# EAGLE schematic mcp3008_rpi_new (EAGLE 7.2.0)
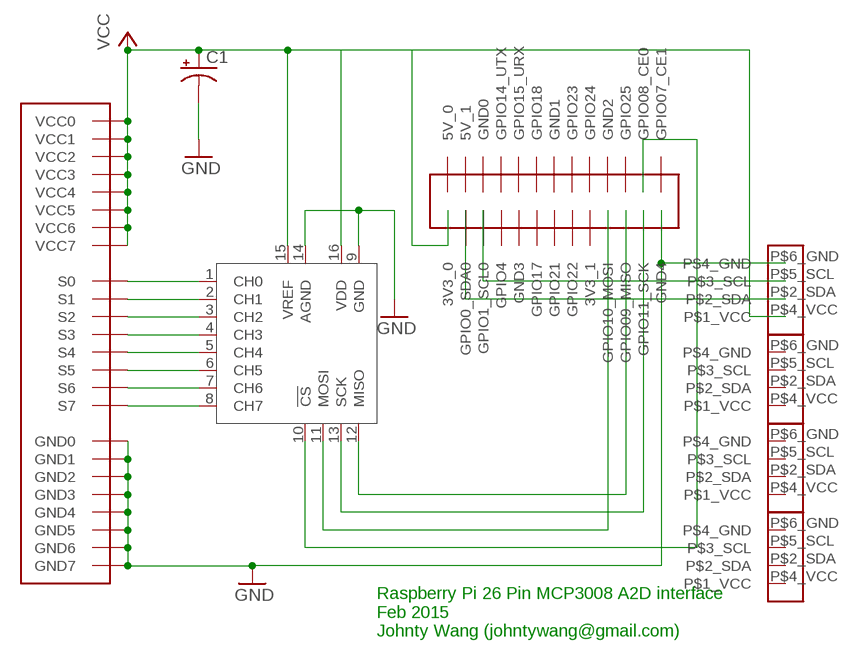
[diagram p0: schematic, sheet 1]

## Parts
C1  CPOL-USE2.5-6  [E2,5-6]
U$1  3BY83X8_SAMTEC  [3X8_PKG]
U$2  RPI_26  [RPI26]
U$3  MCP3008P  [DIL16]
U$4  ICUBE_I2C  [2X3]
U$5  ICUBE_I2C  [2X3]
U$6  ICUBE_I2C  [2X3]
U$7  ICUBE_I2C  [2X3]

## Nets
GND: C1.- U$1.GND0 U$1.GND1 U$1.GND2 U$1.GND3 U$1.GND4 U$1.GND5 U$1.GND6 U$1.GND7 U$2.GND4 U$3.9(GND) U$3.14(AGND) U$4.P$6_GND(P$4_GND)
N$1: U$1.S0 U$3.1(CH0)
N$2: U$1.S1 U$3.2(CH1)
N$3: U$1.S2 U$3.3(CH2)
N$4: U$1.S3 U$3.4(CH3)
N$5: U$1.S4 U$3.5(CH4)
N$6: U$1.S5 U$3.6(CH5)
N$7: U$1.S6 U$3.7(CH6)
N$8: U$1.S7 U$3.8(CH7)
N$9: U$2.GPIO09(GPIO09_MISO) U$3.12(MISO)
N$10: U$2.GPIO11(GPIO11_SCK) U$3.13(SCK)
N$11: U$2.GPIO10(GPIO10_MOSI) U$3.11(MOSI)
N$12: U$2.GPIO08(GPIO08_CE0) U$3.10(!CS)
N$14: U$2.GPIO01(GPIO1_SCL0) U$4.P$5_SCL(P$3_SCL)
N$15: U$2.GPIO0(GPIO0_SDA0) U$4.P$2_SDA
VCC: C1.+ U$1.VCC0 U$1.VCC1 U$1.VCC2 U$1.VCC3 U$1.VCC4 U$1.VCC5 U$1.VCC6 U$1.VCC7 U$2.3V3_0 U$3.15(VREF) U$3.16(VDD) U$4.P$4_VCC(P$1_VCC)
Unconnected: U$2.3V3_1 U$2.5V1(5V_1) U$2.GND0 U$2.GND1 U$2.GND2 U$2.GND3 U$2.GPIO04(GPIO4) U$2.GPIO07(GPIO07_CE1) U$2.GPIO14(GPIO14_UTX) U$2.GPIO15(GPIO15_URX) U$2.GPIO17 U$2.GPIO18 U$2.GPIO21 U$2.GPIO22 U$2.GPIO23 U$2.GPIO24 U$2.GPIO25 U$5.P$2_SDA U$5.P$4_VCC(P$1_VCC) U$5.P$5_SCL(P$3_SCL) U$5.P$6_GND(P$4_GND) U$6.P$2_SDA U$6.P$4_VCC(P$1_VCC) U$6.P$5_SCL(P$3_SCL) U$6.P$6_GND(P$4_GND) U$7.P$2_SDA U$7.P$4_VCC(P$1_VCC) U$7.P$5_SCL(P$3_SCL) U$7.P$6_GND(P$4_GND)

## Notes on the sheet
- Raspberry Pi 26 Pin MCP3008 A2D interface
  Feb 2015
  Johnty Wang (johntywang@gmail.com)

## Power pins joined to a net without a drawn wire
5V_0: U$2.5V0(5V_0)

## Library data of the parts
C1 = rcl:CPOL-US: POLARIZED CAPACITOR, American symbol
U$1 = jt_lib:3BY8: a 3 by 8 header
U$2 = jt_lib:RPI_26: RPi GPIO header (26 pin)
U$3 = MCP3008:MCP3008
U$4-U$7 = jt_lib:ICUBE_I2C: 2x3 pin header for ICubeX i2c sensors

## Net classes
0 default: width 0.254 mm